# Altium schematic sheet PROC054D_AWR_1_AWR_4_LC_Filtering.SchDoc: AWR_1_AWR_4_LC_Filtering
size 558 x 431 mm; Date: Not shown in title block; ApprovedBy: Not shown in title block; CheckedBy: Not shown in title block; Author: Not shown in title block; CompanyName: Not shown in title block; DrawnBy: a0271760; Engineer: Not shown in title block; Organization: Not shown in title block; Address1: Not shown in title block; Address2: Not shown in title block; Address3: Not shown in title block; Address4: Not shown in title block; DocumentNumber: 6; Revision: Use project pAWRameter SCH_Rev; SheetNumber: 6; SheetTotal: 19; PageSetup: Record=PageOptions|CenterHorizontal=True|CenterVertical=True|PrintScale=1.00|XCorrection=1.00|YCorrection=1.00|PrintKind=0|BorderSize=5000000|LeftOffset=0|BottomOffset=0|Orientation=2|PaperLength=1000|PaperWidth=1000|Scale=100|PaperSource=15|PrintQuality=600|MediaType=1|DitherType=10|PaperKind=Letter|PrintScaleMode=1; CurrentTime: Not shown in title block; CurrentDate: Not shown in title block; Time: Not shown in title block; DocumentFullPathAndName: Not shown in title block; DocumentName: Not shown in title block; ModifiedDate: Not shown in title block; ImagePath: Not shown in title block
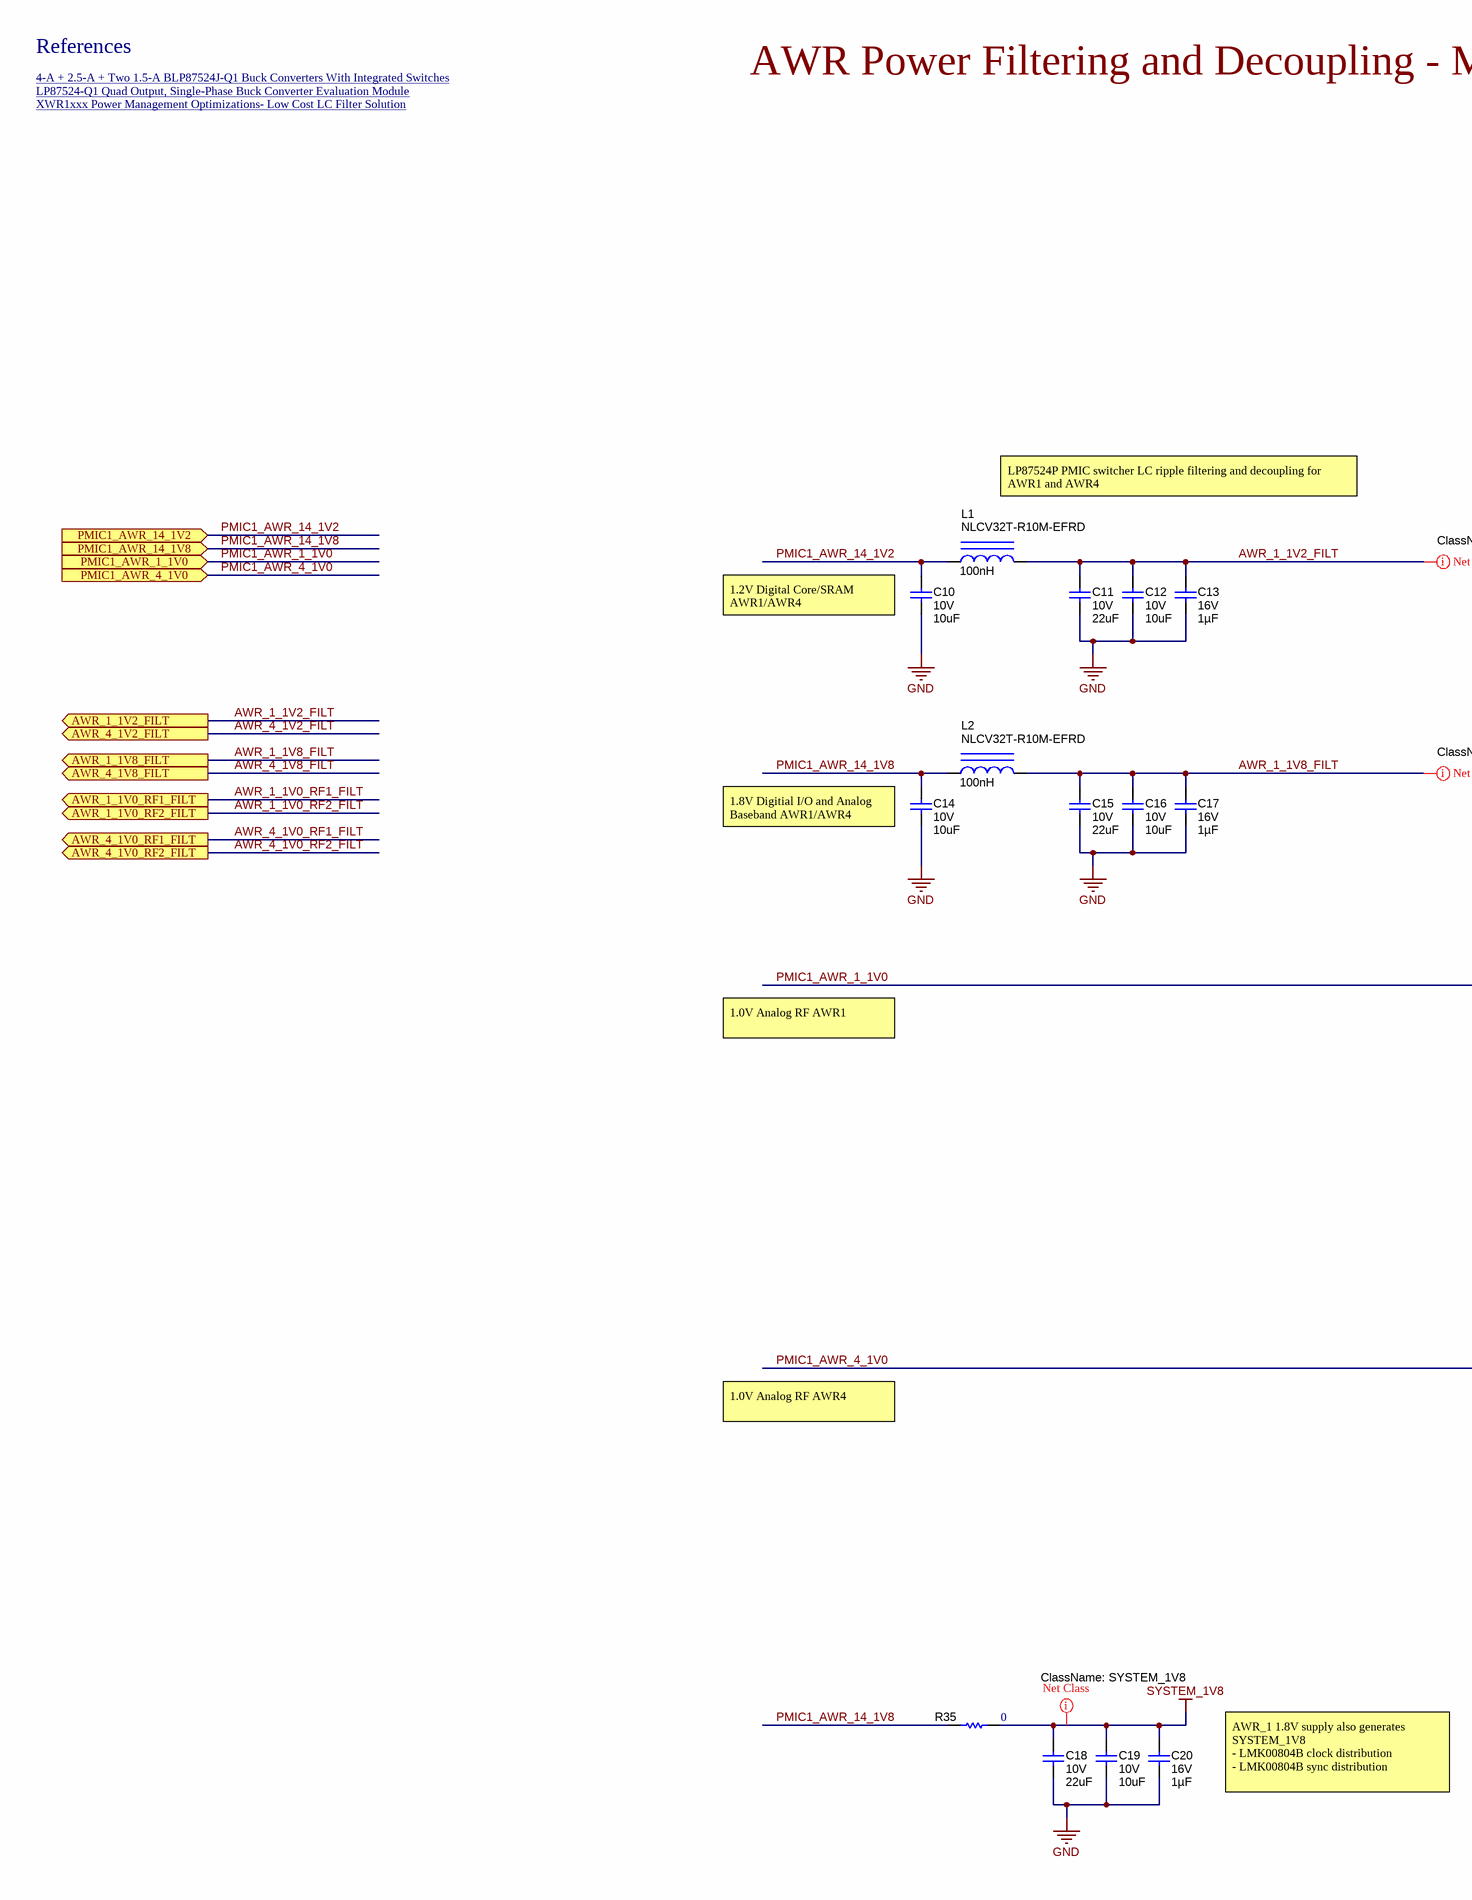
[diagram p0: PROC054D_AWR_1_AWR_4_LC_Filtering.SchDoc, left]
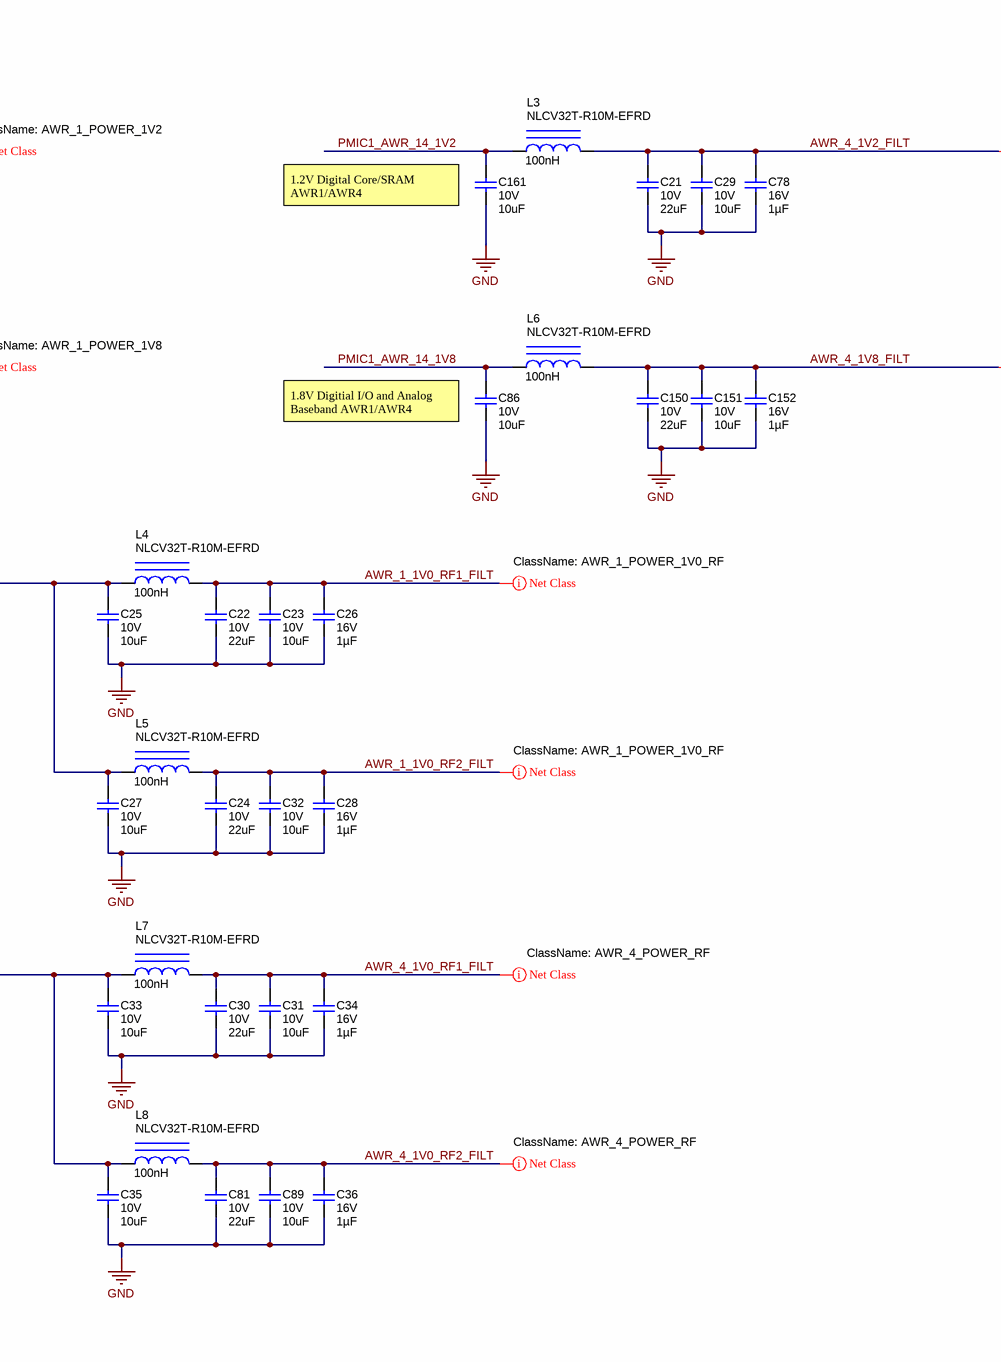
[diagram p1: PROC054D_AWR_1_AWR_4_LC_Filtering.SchDoc, right]

## Parts
C10  VDC_V: 10V  ValueDisplayed: 10uF  [0805L]  (hidden comment: GCM21BR71A106KE22L)
C11  VDC_V: 10V  ValueDisplayed: 22uF  [1206_180L]  (hidden comment: GCM31CR71A226KE02)
C12  VDC_V: 10V  ValueDisplayed: 10uF  [0805L]  (hidden comment: GCM21BR71A106KE22L)
C13  VDC_V: 16V  ValueDisplayed: 1µF  [0603S]  (hidden comment: GCM188R71C105KA64J)
C14  VDC_V: 10V  ValueDisplayed: 10uF  [0805L]  (hidden comment: GCM21BR71A106KE22L)
C15  VDC_V: 10V  ValueDisplayed: 22uF  [1206_180L]  (hidden comment: GCM31CR71A226KE02)
C16  VDC_V: 10V  ValueDisplayed: 10uF  [0805L]  (hidden comment: GCM21BR71A106KE22L)
C17  VDC_V: 16V  ValueDisplayed: 1µF  [0603S]  (hidden comment: GCM188R71C105KA64J)
C18  VDC_V: 10V  ValueDisplayed: 22uF  [1206_180L]  (hidden comment: GCM31CR71A226KE02)
C19  VDC_V: 10V  ValueDisplayed: 10uF  [0805L]  (hidden comment: GCM21BR71A106KE22L)
C20  VDC_V: 16V  ValueDisplayed: 1µF  [0603S]  (hidden comment: GCM188R71C105KA64J)
C21  VDC_V: 10V  ValueDisplayed: 22uF  [1206_180L]  (hidden comment: GCM31CR71A226KE02)
C22  VDC_V: 10V  ValueDisplayed: 22uF  [1206_180L]  (hidden comment: GCM31CR71A226KE02)
C23  VDC_V: 10V  ValueDisplayed: 10uF  [0805L]  (hidden comment: GCM21BR71A106KE22L)
C24  VDC_V: 10V  ValueDisplayed: 22uF  [1206_180L]  (hidden comment: GCM31CR71A226KE02)
C25  VDC_V: 10V  ValueDisplayed: 10uF  [0805L]  (hidden comment: GCM21BR71A106KE22L)
C26  VDC_V: 16V  ValueDisplayed: 1µF  [0603S]  (hidden comment: GCM188R71C105KA64J)
C27  VDC_V: 10V  ValueDisplayed: 10uF  [0805L]  (hidden comment: GCM21BR71A106KE22L)
C28  VDC_V: 16V  ValueDisplayed: 1µF  [0603S]  (hidden comment: GCM188R71C105KA64J)
C29  VDC_V: 10V  ValueDisplayed: 10uF  [0805L]  (hidden comment: GCM21BR71A106KE22L)
C30  VDC_V: 10V  ValueDisplayed: 22uF  [1206_180L]  (hidden comment: GCM31CR71A226KE02)
C31  VDC_V: 10V  ValueDisplayed: 10uF  [0805L]  (hidden comment: GCM21BR71A106KE22L)
C32  VDC_V: 10V  ValueDisplayed: 10uF  [0805L]  (hidden comment: GCM21BR71A106KE22L)
C33  VDC_V: 10V  ValueDisplayed: 10uF  [0805L]  (hidden comment: GCM21BR71A106KE22L)
C34  VDC_V: 16V  ValueDisplayed: 1µF  [0603S]  (hidden comment: GCM188R71C105KA64J)
C35  VDC_V: 10V  ValueDisplayed: 10uF  [0805L]  (hidden comment: GCM21BR71A106KE22L)
C36  VDC_V: 16V  ValueDisplayed: 1µF  [0603S]  (hidden comment: GCM188R71C105KA64J)
C78  VDC_V: 16V  ValueDisplayed: 1µF  [0603S]  (hidden comment: GCM188R71C105KA64J)
C81  VDC_V: 10V  ValueDisplayed: 22uF  [1206_180L]  (hidden comment: GCM31CR71A226KE02)
C86  VDC_V: 10V  ValueDisplayed: 10uF  [0805L]  (hidden comment: GCM21BR71A106KE22L)
C89  VDC_V: 10V  ValueDisplayed: 10uF  [0805L]  (hidden comment: GCM21BR71A106KE22L)
C150  VDC_V: 10V  ValueDisplayed: 22uF  [1206_180L]  (hidden comment: GCM31CR71A226KE02)
C151  VDC_V: 10V  ValueDisplayed: 10uF  [0805L]  (hidden comment: GCM21BR71A106KE22L)
C152  VDC_V: 16V  ValueDisplayed: 1µF  [0603S]  (hidden comment: GCM188R71C105KA64J)
C161  VDC_V: 10V  ValueDisplayed: 10uF  [0805L]  (hidden comment: GCM21BR71A106KE22L)
L1  ValueDisplayed: 100nH  [NLCV32]  (hidden comment: NLCV32T-R10M-EFRD)
L2  ValueDisplayed: 100nH  [NLCV32]  (hidden comment: NLCV32T-R10M-EFRD)
L3  ValueDisplayed: 100nH  [NLCV32]  (hidden comment: NLCV32T-R10M-EFRD)
L4  ValueDisplayed: 100nH  [NLCV32]  (hidden comment: NLCV32T-R10M-EFRD)
L5  ValueDisplayed: 100nH  [NLCV32]  (hidden comment: NLCV32T-R10M-EFRD)
L6  ValueDisplayed: 100nH  [NLCV32]  (hidden comment: NLCV32T-R10M-EFRD)
L7  ValueDisplayed: 100nH  [NLCV32]  (hidden comment: NLCV32T-R10M-EFRD)
L8  ValueDisplayed: 100nH  [NLCV32]  (hidden comment: NLCV32T-R10M-EFRD)
R35  ValueDisplayed: 0  [0805_HV]  (hidden comment: PMR10EZPJ000)

## Ports
AWR_1_1V0_RF1_FILT (out), AWR_1_1V0_RF2_FILT (out), AWR_1_1V2_FILT (out), AWR_1_1V8_FILT (out), AWR_4_1V0_RF1_FILT (out), AWR_4_1V0_RF2_FILT (out), AWR_4_1V2_FILT (out), AWR_4_1V8_FILT (out), PMIC1_AWR_1_1V0 (in), PMIC1_AWR_4_1V0 (in), PMIC1_AWR_14_1V2 (in), PMIC1_AWR_14_1V8 (in)

## Nets
GND: C10.2 C11.2 C12.2 C13.2 C14.2 C15.2 C16.2 C17.2 C18.2 C19.2 C20.2 C21.2 C22.2 C23.2 C24.2 C25.2 C26.2 C27.2 C28.2 C29.2 C30.2 C31.2 C32.2 C33.2 C34.2 C35.2 C36.2 C78.2 C81.2 C86.2 C89.2 C150.2 C151.2 C152.2 C161.2
SYSTEM_1V8: C18.1 C19.1 C20.1 R35.2
AWR_1_1V0_RF1_FILT: C22.1 C23.1 C26.1 L4.2 ; port AWR_1_1V0_RF1_FILT
AWR_1_1V0_RF2_FILT: C24.1 C28.1 C32.1 L5.2 ; port AWR_1_1V0_RF2_FILT
AWR_1_1V2_FILT: C11.1 C12.1 C13.1 L1.2 ; port AWR_1_1V2_FILT
AWR_1_1V8_FILT: C15.1 C16.1 C17.1 L2.2 ; port AWR_1_1V8_FILT
AWR_4_1V0_RF1_FILT: C30.1 C31.1 C34.1 L7.2 ; port AWR_4_1V0_RF1_FILT
AWR_4_1V0_RF2_FILT: C36.1 C81.1 C89.1 L8.2 ; port AWR_4_1V0_RF2_FILT
AWR_4_1V2_FILT: C21.1 C29.1 C78.1 L3.2 ; port AWR_4_1V2_FILT
AWR_4_1V8_FILT: C150.1 C151.1 C152.1 L6.2 ; port AWR_4_1V8_FILT
PMIC1_AWR_1_1V0: C25.1 C27.1 L4.1 L5.1 ; port PMIC1_AWR_1_1V0
PMIC1_AWR_4_1V0: C33.1 C35.1 L7.1 L8.1 ; port PMIC1_AWR_4_1V0
PMIC1_AWR_14_1V2: C10.1 C161.1 L1.1 L3.1 ; port PMIC1_AWR_14_1V2
PMIC1_AWR_14_1V8: C14.1 C86.1 L2.1 L6.1 R35.1 ; port PMIC1_AWR_14_1V8

## Layout directives
net class AWR_1_POWER_1V2: AWR_1_1V2_FILT
net class AWR_1_POWER_1V0_RF: AWR_1_1V0_RF1_FILT, AWR_1_1V0_RF2_FILT
net class AWR_4_POWER_RF: AWR_4_1V0_RF1_FILT, AWR_4_1V0_RF2_FILT
net class SYSTEM_1V8: SYSTEM_1V8
net class AWR_1_POWER_1V8: AWR_1_1V8_FILT
net class AWR_4_POWER_1V2: AWR_4_1V2_FILT
net class AWR_4_POWER_1V8: AWR_4_1V8_FILT

## Notes on the sheet
- References
- LP87524-Q1 Quad Output, Single-Phase Buck Converter Evaluation Module <http://www.ti.com/tool/lp87524q1evm>
- XWR1xxx Power Management Optimizations- Low Cost LC Filter Solution <http://www.ti.com/lit/pdf/swra577>
- 4-A + 2.5-A + Two 1.5-A BLP87524J-Q1 Buck Converters With Integrated Switches <http://www.ti.com/product/lp87524j-q1>
- AWR Power Filtering and Decoupling - Master AWR_1 and Slave AWR_4
- LP87524P PMIC switcher LC ripple filtering and decoupling for AWR1 and AWR4
- (near C10) 1.2V Digital Core/SRAM AWR1/AWR4
- (near C161) 1.2V Digital Core/SRAM AWR1/AWR4
- (near C14) 1.8V Digitial I/O and Analog Baseband AWR1/AWR4
- (near C86) 1.8V Digitial I/O and Analog Baseband AWR1/AWR4
- 1.0V Analog RF AWR1
- 1.0V Analog RF AWR4
- AWR_1 1.8V supply also generates SYSTEM_1V8
  - LMK00804B clock distribution
  - LMK00804B sync distribution
- Drawn By:
- SVN Rev:
- Number:
- TID #:
- Orderable:
- Rev:
- Sheet Title:
- File:
- Project Title:
- Designed for:
- Assembly VAWRiant:
- Mod. Date:
- Sheet:
- Size:
- of
- C
- http://www.ti.com
- Texas Instruments and/or its licensors do not wAWRrant the accuracy or completeness of this specification or any information contained therein. Texas Instruments and/or its licensors do not wAWRrant that this design will meet the specifications, will be suitable for your application or fit for any pAWRticulAWR purpose, or will operate in an implementation. Texas Instruments and/or its licensors do not wAWRrant that the design is production worthy. You should completely validate and test your design implementation to confirm the system functionality for your application.
- Engineer:
- Contact:
- © Texas Instruments

## Library data of the parts
C10 C12 C14 C16 C23 C25 C27 C29 C31-C33 C35 C86 C89 C151 C161 = CMP-0008017-2: CAP, CERM, 10 uF, 10 V, +/- 10%, X7R, 0805; Manufacturer: MuRata; TaMin_C: -55°C; Polarized: N; SizeAreaWB_mm2: 6.75; Value1: Unknown; U/M: EA; Value: 10uF; TaMax_C: 125°C; SizeZ_mm: 1.45; SizeX_mm: 2; SizeY_mm: 1.25; Cap_Case: 0805; SizeArea_mm2: 2.5; Cap_F: 10µF; AEC Category: Q200; Supplier Part Number 2: 06AC6014; Publisher: Texas Instruments; Supplier 2: Newark; Supplier Part Number 3: 81-GCM21BR71A106KE2L; TempCo: X7R; Supplier 3: Mouser; Published: 2008-06-19; RoHS: Y; MountType: SMT; Supplier 1: Digi-Key; PackageReference: 0805; Tolerance_%: 10%; Value2: 10V; CompType: Capacitor; LatestRevisionDate: 2017-03-09; PartNumber: GCM21BR71A106KE22L; AEC Qualified: ?; ComponentLink1Description: Datasheet link; Supplier Part Number 1: 490-10674-1-ND; Technology: Ceramic; ComponentLink1URL: http://www.murata.com/products/catalog/pdf/c03e.pdf
C11 C18 = CMP-0008811-2: CAP, CERM, 22 uF, 10 V, +/- 10%, X7R, AEC-Q200 Grade 1, 1206; Manufacturer: MuRata; TaMin_C: -55°C; Polarized: N; SizeAreaWB_mm2: 10.92; Value1: Unknown; U/M: EA; Value: 22uF; TaMax_C: 125°C; SizeZ_mm: 1.8; SizeX_mm: 3.2; SizeY_mm: 1.6; Cap_Case: 1206; SizeArea_mm2: 5.12; CompType: Capacitor; AEC Qualified: Y; Cap_F: 22µF; AEC Grade: 1; AEC Category: Q200; Publisher: Texas Instruments; TempCo: X7R; Published: 2008-06-19; RoHS: Y; MountType: SMT; PackageReference: 1206; Tolerance_%: 10%; Value2: 10V; LatestRevisionDate: 2017-03-09; PartNumber: GCM31CR71A226KE02; ComponentLink1Description: Datasheet link; Technology: Ceramic; ComponentLink1URL: http://psearch.en.murata.com/capacitor/product/GCM31CR71A226KE02%23.pdf
C13 C17 C26 C28 C34 C36 C78 C152 = CMP-0079154-1: CAP, CERM, 1 µF, 16 V,+/- 10%, X7R, AEC-Q200 Grade 1, 0603; Manufacturer: MuRata; SizeAreaWB_mm2: 4.68; SizeArea_mm2: 1.28; AEC Qualified: Y; AEC Category: Q200; Value: 1uF; TaMax_C: 125°C; SizeZ_mm: 1; Polarized: N; TaMin_C: -55°C; SizeY_mm: 0.8; U/M: EA; SizeX_mm: 1.6; Cap_Case: 0603; ComponentLink1Description: Datasheet link; Cap_F: 1µF; RoHS: Y; Tolerance_%: 10%; Supplier 1: Digi-Key; PackageReference: 0603; Technology: Ceramic; PartNumber: GCM188R71C105KA64J; TempCo: X7R; Supplier Part Number 2: 81-GCM188R71C105KA4J; Supplier 2: Mouser; AEC Grade: 1; Value2: 16V; ComponentLink1URL: https://www.murata.com/~/media/webrenewal/support/library/catalog/products/capacitor/mlcc/c03e.ashx; CompType: Capacitor; MountType: SMT; Supplier Part Number 1: 490-12657-1-ND
C15 C21 C22 C24 C30 C81 C150 = CMP-0008811-2: CAP, CERM, 22 uF, 10 V, +/- 10%, X7R, AEC-Q200 Grade 1, 1206; Manufacturer: MuRata; TaMin_C: -55°C; Polarized: N; SizeAreaWB_mm2: 10.92; Value1: Unknown; U/M: EA; Value: 22uF; TaMax_C: 125°C; SizeZ_mm: 1.8; SizeX_mm: 3.2; SizeY_mm: 1.6; Cap_Case: 1206; SizeArea_mm2: 5.12; AEC Qualified: Y; Cap_F: 22µF; AEC Grade: 1; AEC Category: Q200; Publisher: Texas Instruments; TempCo: X7R; Published: 2008-06-19; RoHS: Y; MountType: SMT; PackageReference: 1206; Tolerance_%: 10%; Value2: 10V; CompType: Capacitor; LatestRevisionDate: 2017-03-09; PartNumber: GCM31CR71A226KE02; ComponentLink1Description: Datasheet link; Technology: Ceramic; ComponentLink1URL: http://psearch.en.murata.com/capacitor/product/GCM31CR71A226KE02%23.pdf
C19 = CMP-0008017-2: CAP, CERM, 10 uF, 10 V, +/- 10%, X7R, 0805; Manufacturer: MuRata; TaMin_C: -55°C; Polarized: N; SizeAreaWB_mm2: 6.75; Value1: Unknown; U/M: EA; Value: 10uF; TaMax_C: 125°C; SizeZ_mm: 1.45; SizeX_mm: 2; SizeY_mm: 1.25; Cap_Case: 0805; SizeArea_mm2: 2.5; CompType: Capacitor; Cap_F: 10µF; AEC Category: Q200; Supplier Part Number 2: 06AC6014; Publisher: Texas Instruments; Supplier 2: Newark; Supplier Part Number 3: 81-GCM21BR71A106KE2L; TempCo: X7R; Supplier 3: Mouser; Published: 2008-06-19; RoHS: Y; MountType: SMT; Supplier 1: Digi-Key; PackageReference: 0805; Tolerance_%: 10%; Value2: 10V; LatestRevisionDate: 2017-03-09; PartNumber: GCM21BR71A106KE22L; AEC Qualified: ?; ComponentLink1Description: Datasheet link; Supplier Part Number 1: 490-10674-1-ND; Technology: Ceramic; ComponentLink1URL: http://www.murata.com/products/catalog/pdf/c03e.pdf
C20 = CMP-0079154-1: CAP, CERM, 1 µF, 16 V,+/- 10%, X7R, AEC-Q200 Grade 1, 0603; Manufacturer: MuRata; SizeAreaWB_mm2: 4.68; SizeArea_mm2: 1.28; AEC Qualified: Y; AEC Category: Q200; Value: 1uF; TaMax_C: 125°C; SizeZ_mm: 1; Polarized: N; TaMin_C: -55°C; SizeY_mm: 0.8; U/M: EA; CompType: Capacitor; SizeX_mm: 1.6; Cap_Case: 0603; ComponentLink1Description: Datasheet link; Cap_F: 1µF; RoHS: Y; Tolerance_%: 10%; Supplier 1: Digi-Key; PackageReference: 0603; Technology: Ceramic; PartNumber: GCM188R71C105KA64J; TempCo: X7R; Supplier Part Number 2: 81-GCM188R71C105KA4J; Supplier 2: Mouser; AEC Grade: 1; Value2: 16V; ComponentLink1URL: https://www.murata.com/~/media/webrenewal/support/library/catalog/products/capacitor/mlcc/c03e.ashx; MountType: SMT; Supplier Part Number 1: 490-12657-1-ND
L1-L8 = CMP-0083745-1: Inductor, Wirewound, Ferrite, 100 nH, 2.85 A, 0.024 ohm, AEC-Q200 Grade 1, SMD; Manufacturer: TDK; Isat: 2.85A @ 10% inductance drop; Irms: 2.85A @ 40C rise; SizeAreaWB_mm2: 13.44; DCR_ohm: 0.024; Value: 100nH; Imax_A: 2.85A; SizeZ_mm: 2.5; SizeX_mm: 3.2; SizeY_mm: 2.2; SizeArea_mm2: 7.04; AEC Qualified: Y; AEC Grade: 1; AEC Category: Q200; ComponentLink1URL: https://product.tdk.com/info/en/catalog/datasheets/inductor_automotive_decoupling_nlcv32-efrd_en.pdf; RoHS: Y; Value1: 0.024 ohm; Material: Ferrite; MountType: SMT; PackageReference: 3.2x2.2x2.5mm; Value2: 2.85A; CompType: Inductor; Ind_H: 100nH; PartNumber: NLCV32T-R10M-EFRD; ComponentLink1Description: Datasheet link; Technology: Wirewound
R35 = CMP-0081857-1: RES, 0, 0%,  W, AEC-Q200 Grade 0, 0805; Manufacturer: Rohm; SizeAreaWB_mm2: 6.75; SizeArea_mm2: 2.5; AEC Qualified: Y; AEC Category: Q200; Value: 0; SizeZ_mm: 1.45; SizeY_mm: 1.25; SizeX_mm: 2; ComponentLink1Description: Datasheet link; RoHS: Y; Tolerance_%: 0%; Value_Code: 0; Supplier 1: Mouser; PackageReference: 0805; Technology: Thick Film; Res_ohm: 0; PartNumber: PMR10EZPJ000; AEC Grade: 0; Value2: W; ComponentLink1URL: http://www.rohm.com/web/global/datasheet/PMR10EZPJ000/pmr-jpw-e; Value1: 0%; CompType: Resistor; MountType: SMT; Supplier Part Number 1: 755-PMR10EZPJ000